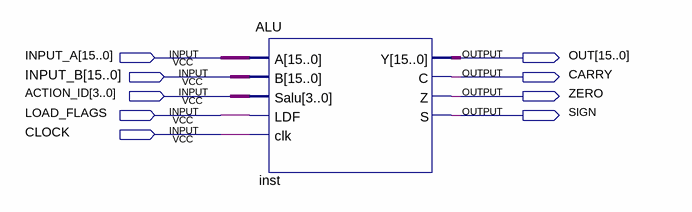
[diagram p0: schematic sheet]
// Quartus schematic alu.test.bdf as structural Verilog: 1 symbols, 9 pins
module \alu.test  (
  input  [15:0] INPUT_A,
  input  [15:0] INPUT_B,
  input  [3:0] ACTION_ID,
  input  LOAD_FLAGS,
  input  CLOCK,
  output [15:0] OUT,
  output CARRY,
  output ZERO,
  output SIGN
);

  ALU inst (
    .A(INPUT_A), .B(INPUT_B), .Salu(ACTION_ID), .LDF(LOAD_FLAGS), .clk(CLOCK), .Y(OUT), .C(CARRY), .Z(ZERO),
    .S(SIGN));
endmodule
